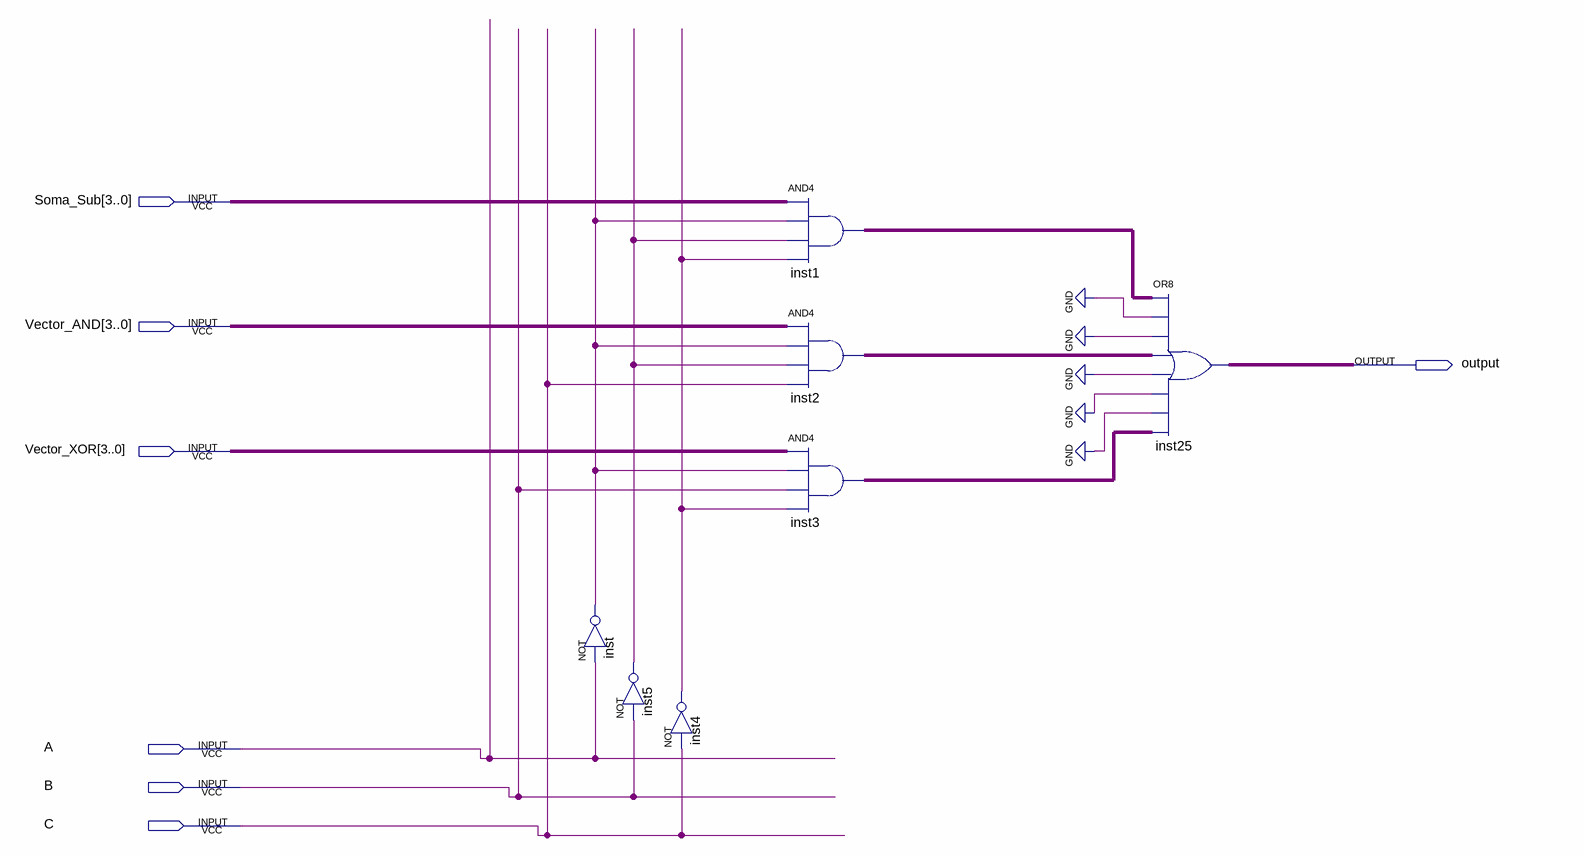
[diagram p0: schematic sheet]
// Quartus schematic Vector_MUX.bdf as structural Verilog: 7 symbols, 7 pins
module Vector_MUX (
  input  [3:0] Soma_Sub,
  input  [3:0] Vector_AND,
  input  [3:0] Vector_XOR,
  input  A,
  input  B,
  input  C,
  output \output 
);

  wire inst4_out, inst5_out, inst_out;
  wire [3:0] inst1_out, inst2_out, inst3_out, inst25_out;

  not inst (inst_out, A);
  not inst5 (inst5_out, B);
  not inst4 (inst4_out, C);
  assign inst1_out = Soma_Sub & {4{inst_out}} & {4{inst5_out}} & {4{inst4_out}};  // AND4 inst1, 4 bits wide
  assign inst2_out = Vector_AND & {4{inst_out}} & {4{inst5_out}} & {4{C}};  // AND4 inst2, 4 bits wide
  assign inst3_out = Vector_XOR & {4{inst_out}} & {4{B}} & {4{inst4_out}};  // AND4 inst3, 4 bits wide
  assign inst25_out = inst1_out | 4'b0000 | 4'b0000 | inst2_out | 4'b0000 | 4'b0000 | 4'b0000 | inst3_out;  // OR8 inst25, 4 bits wide
endmodule
